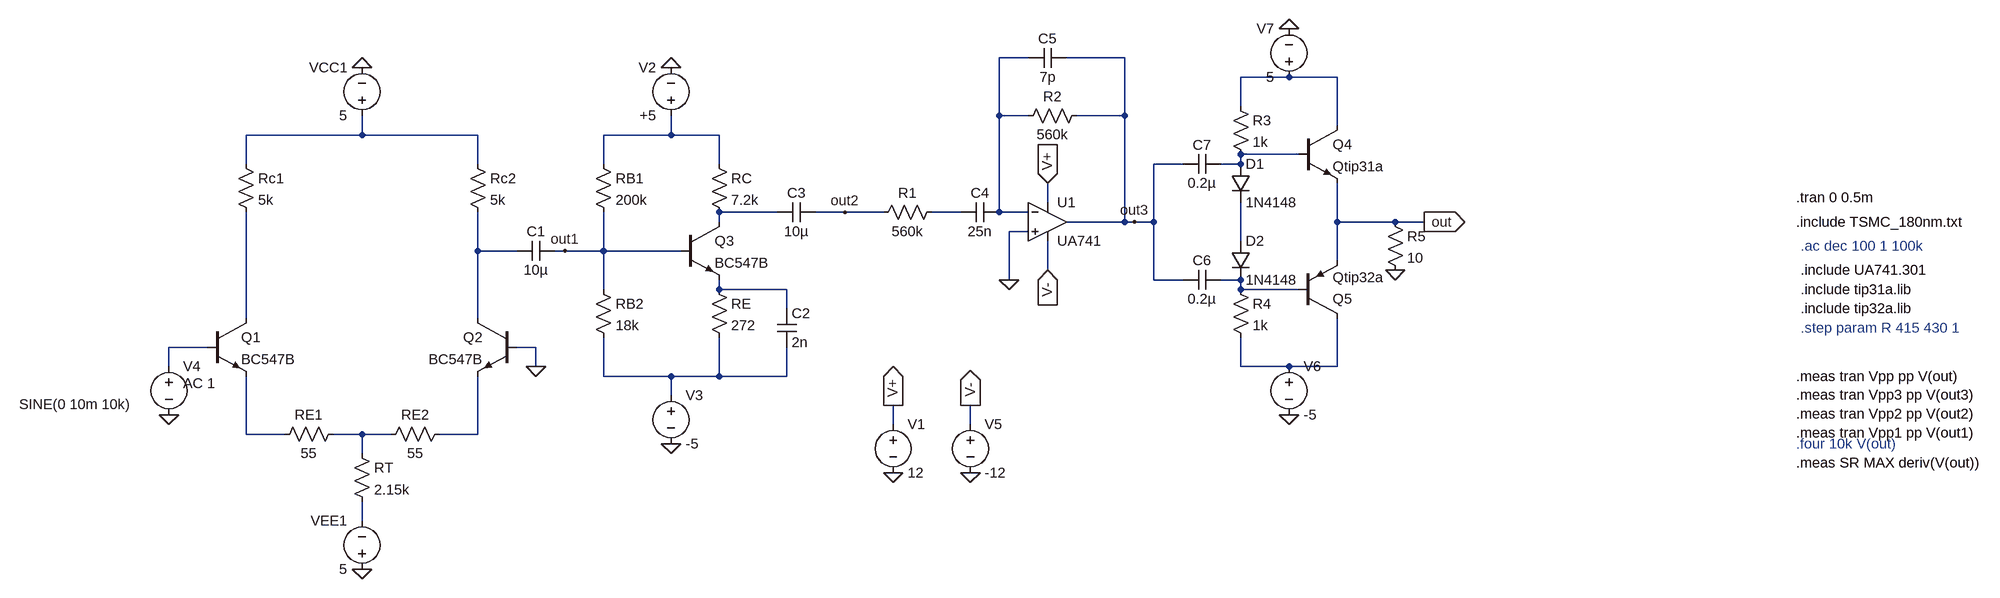
[diagram p0: schematic finalckt.asc]
finalckt.asc, the LTspice schematic file:
Version 4
SHEET 1 2248 932
WIRE 608 -224 560 -224
WIRE 768 -224 672 -224
WIRE 1040 -192 960 -192
WIRE 1120 -192 1040 -192
WIRE 960 -144 960 -192
WIRE 560 -128 560 -224
WIRE 608 -128 560 -128
WIRE 768 -128 768 -224
WIRE 768 -128 688 -128
WIRE 1120 -112 1120 -192
WIRE -496 -96 -496 -128
WIRE -496 -96 -688 -96
WIRE -304 -96 -496 -96
WIRE 16 -96 16 -128
WIRE 16 -96 -96 -96
WIRE 96 -96 16 -96
WIRE 1056 -64 960 -64
WIRE -688 -48 -688 -96
WIRE -304 -48 -304 -96
WIRE -96 -48 -96 -96
WIRE 96 -48 96 -96
WIRE 864 -48 816 -48
WIRE 960 -48 960 -64
WIRE 960 -48 928 -48
WIRE 640 16 640 -16
WIRE 192 32 96 32
WIRE 304 32 256 32
WIRE 368 32 304 32
WIRE 496 32 448 32
WIRE 560 32 560 -128
WIRE 608 32 560 32
WIRE 96 48 96 32
WIRE 768 48 768 -128
WIRE 768 48 672 48
WIRE 784 48 768 48
WIRE 816 48 816 -48
WIRE 816 48 784 48
WIRE 1120 48 1120 -16
WIRE 1216 48 1120 48
WIRE 1264 48 1216 48
WIRE 608 64 576 64
WIRE 960 80 960 16
WIRE -304 96 -304 32
WIRE -240 96 -304 96
WIRE -160 96 -176 96
WIRE -96 96 -96 32
WIRE -96 96 -160 96
WIRE 32 96 -96 96
WIRE 1120 112 1120 48
WIRE 640 128 640 80
WIRE 576 144 576 64
WIRE 816 144 816 48
WIRE 864 144 816 144
WIRE 960 144 928 144
WIRE -96 160 -96 96
WIRE 96 160 96 144
WIRE 208 160 96 160
WIRE 960 160 960 144
WIRE 1056 160 960 160
WIRE 208 192 208 160
WIRE -688 208 -688 32
WIRE -304 208 -304 96
WIRE -752 256 -816 256
WIRE -208 256 -240 256
WIRE -816 288 -816 256
WIRE -208 288 -208 256
WIRE 960 288 960 240
WIRE 1040 288 960 288
WIRE 1120 288 1120 208
WIRE 1120 288 1040 288
WIRE -96 304 -96 240
WIRE 16 304 -96 304
WIRE 96 304 96 240
WIRE 96 304 16 304
WIRE 208 304 208 256
WIRE 208 304 96 304
WIRE 16 336 16 304
WIRE 384 384 384 352
WIRE 512 384 512 352
WIRE -688 400 -688 304
WIRE -624 400 -688 400
WIRE -496 400 -544 400
WIRE -448 400 -496 400
WIRE -304 400 -304 304
WIRE -304 400 -368 400
WIRE -496 432 -496 400
WIRE -496 544 -496 512
FLAG 16 -208 0
FLAG 16 416 0
FLAG -496 -208 0
FLAG -208 288 0
FLAG -496 624 0
FLAG -816 368 0
FLAG 640 -16 V+
IOPIN 640 -16 In
FLAG 640 128 V-
IOPIN 640 128 In
FLAG 576 144 0
FLAG 384 464 0
FLAG 512 464 0
FLAG 384 352 V+
IOPIN 384 352 Out
FLAG 512 352 V-
IOPIN 512 352 Out
FLAG 1040 -272 0
FLAG 1040 368 0
FLAG 1216 128 0
FLAG 1264 48 out
IOPIN 1264 48 Out
FLAG 784 48 out3
FLAG -160 96 out1
FLAG 304 32 out2
SYMBOL res -112 -64 R0
SYMATTR InstName RB1
SYMATTR Value 200k
SYMBOL res -112 144 R0
SYMATTR InstName RB2
SYMATTR Value 18k
SYMBOL res 80 -64 R0
SYMATTR InstName RC
SYMATTR Value 7.2k
SYMBOL res 80 144 R0
SYMATTR InstName RE
SYMATTR Value 272
SYMBOL cap 192 192 R0
SYMATTR InstName C2
SYMATTR Value 2n
SYMBOL voltage 16 -112 R180
WINDOW 0 24 96 Left 2
WINDOW 3 24 16 Left 2
SYMATTR InstName V2
SYMATTR Value +5
SYMBOL voltage 16 320 R0
SYMATTR InstName V3
SYMATTR Value -5
SYMBOL cap 256 16 R90
WINDOW 0 0 32 VBottom 2
WINDOW 3 32 32 VTop 2
SYMATTR InstName C3
SYMATTR Value 10µ
SYMBOL res -704 -64 R0
SYMATTR InstName Rc1
SYMATTR Value 5k
SYMBOL res -320 -64 R0
SYMATTR InstName Rc2
SYMATTR Value 5k
SYMBOL voltage -496 -112 R180
WINDOW 0 24 96 Left 2
WINDOW 3 24 16 Left 2
WINDOW 123 0 0 Left 0
WINDOW 39 0 0 Left 0
SYMATTR InstName VCC1
SYMATTR Value 5
SYMBOL npn -752 208 R0
SYMATTR InstName Q1
SYMATTR Value BC547B
SYMBOL npn -240 208 M0
SYMATTR InstName Q2
SYMATTR Value BC547B
SYMBOL res -512 416 R0
SYMATTR InstName RT
SYMATTR Value 2.15k
SYMBOL voltage -496 640 R180
WINDOW 0 24 96 Left 2
WINDOW 3 24 16 Left 2
WINDOW 123 0 0 Left 0
WINDOW 39 0 0 Left 0
SYMATTR InstName VEE1
SYMATTR Value 5
SYMBOL voltage -816 272 R0
WINDOW 123 24 44 Left 2
WINDOW 39 0 0 Left 0
WINDOW 3 -248 79 Left 2
SYMATTR Value2 AC 1
SYMATTR Value SINE(0 10m 10k)
SYMATTR InstName V4
SYMBOL res 464 16 R90
WINDOW 0 0 56 VBottom 2
WINDOW 3 32 56 VTop 2
SYMATTR InstName R1
SYMATTR Value 560k
SYMBOL cap 560 16 R90
WINDOW 0 0 32 VBottom 2
WINDOW 3 32 32 VTop 2
SYMATTR InstName C4
SYMATTR Value 25n
SYMBOL voltage 384 368 R0
SYMATTR InstName V1
SYMATTR Value 12
SYMBOL voltage 512 368 R0
SYMATTR InstName V5
SYMATTR Value -12
SYMBOL res 704 -144 R90
WINDOW 0 0 56 VBottom 2
WINDOW 3 32 56 VTop 2
SYMATTR InstName R2
SYMATTR Value 560k
SYMBOL cap 672 -240 R90
WINDOW 0 0 32 VBottom 2
WINDOW 3 32 32 VTop 2
SYMATTR InstName C5
SYMATTR Value 7p
SYMBOL OpAmps\\opamp2 640 -16 R0
SYMATTR InstName U1
SYMATTR Value UA741
SYMBOL res -528 384 R90
WINDOW 0 0 56 VBottom 2
WINDOW 3 32 56 VTop 2
SYMATTR InstName RE1
SYMATTR Value 55
SYMBOL res -352 384 R90
WINDOW 0 0 56 VBottom 2
WINDOW 3 32 56 VTop 2
SYMATTR InstName RE2
SYMATTR Value 55
SYMBOL npn 32 48 R0
SYMATTR InstName Q3
SYMATTR Value BC547B
SYMBOL npn 1056 -112 R0
SYMATTR InstName Q4
SYMATTR Value Qtip31a
SYMBOL diode 944 -48 R0
SYMATTR InstName D1
SYMATTR Value 1N4148
SYMBOL diode 944 80 R0
SYMATTR InstName D2
SYMATTR Value 1N4148
SYMBOL res 944 -160 R0
SYMATTR InstName R3
SYMATTR Value 1k
SYMBOL res 944 144 R0
SYMATTR InstName R4
SYMATTR Value 1k
SYMBOL voltage 1040 272 R0
WINDOW 123 0 0 Left 0
WINDOW 39 0 0 Left 0
SYMATTR InstName V6
SYMATTR Value -5
SYMBOL voltage 1040 -176 R180
WINDOW 0 24 96 Left 2
WINDOW 3 24 16 Left 2
WINDOW 123 0 0 Left 0
WINDOW 39 0 0 Left 0
SYMATTR InstName V7
SYMATTR Value 5
SYMBOL cap 928 128 R90
WINDOW 0 0 32 VBottom 2
WINDOW 3 32 32 VTop 2
SYMATTR InstName C6
SYMATTR Value 0.2µ
SYMBOL cap 928 -64 R90
WINDOW 0 0 32 VBottom 2
WINDOW 3 32 32 VTop 2
SYMATTR InstName C7
SYMATTR Value 0.2µ
SYMBOL cap -176 80 R90
WINDOW 0 0 32 VBottom 2
WINDOW 3 32 32 VTop 2
SYMATTR InstName C1
SYMATTR Value 10µ
SYMBOL pnp 1056 208 M180
SYMATTR InstName Q5
SYMATTR Value Qtip32a
SYMBOL res 1200 32 R0
SYMATTR InstName R5
SYMATTR Value 10
TEXT 1880 8 Left 2 !.tran 0 0.5m
TEXT 1880 48 Left 2 !.include TSMC_180nm.txt
TEXT 1888 88 Left 2 ;.ac dec 100 1 100k
TEXT 1888 128 Left 2 !.include UA741.301
TEXT 1880 304 Left 2 !.meas tran Vpp pp V(out)\n.meas tran Vpp3 pp V(out3)\n.meas tran Vpp2 pp V(out2)\n.meas tran Vpp1 pp V(out1)
TEXT 1888 160 Left 2 !.include tip31a.lib
TEXT 1888 192 Left 2 !.include tip32a.lib
TEXT 1888 224 Left 2 ;.step param R 415 430 1
TEXT 1880 416 Left 2 ;.four 10k V(out)
TEXT 1880 448 Left 2 !.meas SR MAX deriv(V(out))

The netlist it stands for:
* finalckt.asc
RB1 N004 out1 200k
RB2 out1 N015 18k
RC N004 N006 7.2k
RE N011 N015 272
C2 N011 N015 2n
V2 N004 0 +5
V3 N015 0 -5
C3 out2 N006 10µ
Rc1 N003 N012 5k
Rc2 N003 N009 5k
VCC1 N003 0 5
Q1 N012 N013 N016 0 BC547B
Q2 N009 0 N018 0 BC547B
RT N017 N019 2.15k
VEE1 0 N019 5
V4 N013 0 SINE(0 10m 10k) AC 1
R1 N007 out2 560k
C4 N001 N007 25n
V1 V+ 0 12
V5 V- 0 -12
R2 out3 N001 560k
C5 out3 N001 7p
XU1 0 N001 V+ V- out3 UA741  ; pins In+ In- V+ V- OUT
RE1 N017 N016 55
RE2 N018 N017 55
Q3 N006 out1 N011 0 BC547B
Q4 N002 N005 out 0 Qtip31a
D1 N005 N008 1N4148
D2 N008 N010 1N4148
R3 N002 N005 1k
R4 N010 N014 1k
V6 N014 0 -5
V7 N002 0 5
C6 N010 out3 0.2µ
C7 N005 out3 0.2µ
C1 out1 N009 10µ
Q5 N014 N010 out 0 Qtip32a
R5 out 0 10
.model D D
.lib standard.dio
.model NPN NPN
.model PNP PNP
.lib standard.bjt
.tran 0 0.5m
.include TSMC_180nm.txt
* .ac dec 100 1 100k
.include UA741.301
.meas tran Vpp pp V(out)
.meas tran Vpp3 pp V(out3)
.meas tran Vpp2 pp V(out2)
.meas tran Vpp1 pp V(out1)
.include tip31a.lib
.include tip32a.lib
* .step param R 415 430 1
* .four 10k V(out)
.meas SR MAX deriv(V(out))
.backanno
.end